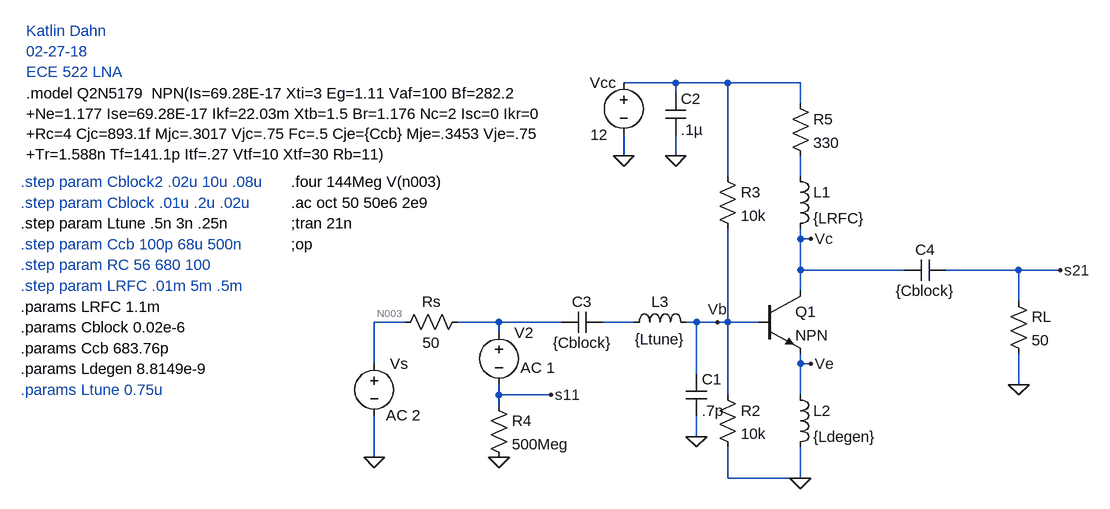
[diagram p0: schematic ECE_522_LNA_v3.asc]
ECE_522_LNA_v3.asc, the LTspice schematic file:
Version 4
SHEET 1 880 680
WIRE -544 -496 -624 -496
WIRE -464 -496 -544 -496
WIRE -352 -496 -464 -496
WIRE -544 -480 -544 -496
WIRE -352 -464 -352 -496
WIRE -624 -384 -624 -416
WIRE -544 -384 -544 -416
WIRE -464 -352 -464 -496
WIRE -352 -352 -352 -384
WIRE -352 -256 -352 -272
WIRE -336 -256 -352 -256
WIRE -352 -208 -352 -256
WIRE -192 -208 -352 -208
WIRE -16 -208 -128 -208
WIRE 48 -208 -16 -208
WIRE -352 -176 -352 -208
WIRE -16 -160 -16 -208
WIRE -960 -128 -1008 -128
WIRE -816 -128 -880 -128
WIRE -720 -128 -816 -128
WIRE -608 -128 -656 -128
WIRE -512 -128 -528 -128
WIRE -480 -128 -512 -128
WIRE -464 -128 -464 -272
WIRE -464 -128 -480 -128
WIRE -416 -128 -464 -128
WIRE -816 -112 -816 -128
WIRE -1008 -64 -1008 -128
WIRE -352 -64 -352 -80
WIRE -336 -64 -352 -64
WIRE -512 -48 -512 -128
WIRE -16 -32 -16 -80
WIRE -816 -16 -816 -32
WIRE -736 -16 -816 -16
WIRE -464 -16 -464 -128
WIRE -352 -16 -352 -64
WIRE -816 0 -816 -16
WIRE -512 48 -512 16
WIRE -1008 80 -1008 16
WIRE -464 112 -464 64
WIRE -352 112 -352 64
WIRE -352 112 -464 112
FLAG -624 -384 0
FLAG -352 112 0
FLAG -544 -384 0
FLAG -1008 80 0
FLAG -16 -32 0
FLAG -816 80 0
FLAG -736 -16 s11
FLAG 48 -208 s21
FLAG -336 -256 Vc
FLAG -336 -64 Ve
FLAG -480 -128 Vb
FLAG -512 48 0
SYMBOL voltage -624 -512 R0
WINDOW 123 0 0 Left 2
WINDOW 39 0 0 Left 2
WINDOW 0 -52 16 Left 2
WINDOW 3 -51 96 Left 2
SYMATTR InstName Vcc
SYMATTR Value 12
SYMBOL npn -416 -176 R0
SYMATTR InstName Q1
SYMBOL cap -560 -480 R0
SYMATTR InstName C2
SYMATTR Value .1µ
SYMBOL res -480 -32 R0
SYMATTR InstName R2
SYMATTR Value 10k
SYMBOL res -480 -368 R0
SYMATTR InstName R3
SYMATTR Value 10k
SYMBOL cap -656 -144 R90
WINDOW 0 0 32 VBottom 2
WINDOW 3 32 32 VTop 2
SYMATTR InstName C3
SYMATTR Value {Cblock}
SYMBOL cap -128 -224 R90
WINDOW 0 0 32 VBottom 2
WINDOW 3 32 32 VTop 2
SYMATTR InstName C4
SYMATTR Value {Cblock}
SYMBOL voltage -1008 -80 R0
WINDOW 3 -235 93 Left 2
WINDOW 123 18 95 Left 2
WINDOW 39 0 0 Left 2
SYMATTR Value ""
SYMATTR Value2 AC 2
SYMATTR InstName Vs
SYMBOL res -32 -176 R0
SYMATTR InstName RL
SYMATTR Value 50
SYMBOL res -864 -144 R90
WINDOW 0 0 56 VBottom 2
WINDOW 3 32 56 VTop 2
SYMATTR InstName Rs
SYMATTR Value 50
SYMBOL voltage -816 -128 R0
WINDOW 123 33 70 Left 2
WINDOW 39 0 0 Left 2
SYMATTR Value2 AC 1
SYMATTR InstName V2
SYMATTR Value ""
SYMBOL res -832 -16 R0
SYMATTR InstName R4
SYMATTR Value 500Meg
SYMBOL res -368 -480 R0
SYMATTR InstName R5
SYMATTR Value 330
SYMBOL ind -368 -368 R0
SYMATTR InstName L1
SYMATTR Value {LRFC}
SYMBOL ind -368 -32 R0
SYMATTR InstName L2
SYMATTR Value {Ldegen}
SYMBOL ind -624 -112 R270
WINDOW 0 32 56 VTop 2
WINDOW 3 5 56 VBottom 2
SYMATTR InstName L3
SYMATTR Value {Ltune}
SYMBOL cap -528 -48 R0
SYMATTR InstName C1
SYMATTR Value .7p
TEXT -1544 -480 Left 2 !.model Q2N5179  NPN(Is=69.28E-17 Xti=3 Eg=1.11 Vaf=100 Bf=282.2 \n+Ne=1.177 Ise=69.28E-17 Ikf=22.03m Xtb=1.5 Br=1.176 Nc=2 Isc=0 Ikr=0 \n+Rc=4 Cjc=893.1f Mjc=.3017 Vjc=.75 Fc=.5 Cje={Ccb} Mje=.3453 Vje=.75 \n+Tr=1.588n Tf=141.1p Itf=.27 Vtf=10 Xtf=30 Rb=11)
TEXT -1136 -280 Left 2 !;tran 21n
TEXT -1552 -120 Left 2 !.params Cblock 0.02e-6
TEXT -1136 -344 Left 2 !.four 144Meg V(n003)
TEXT -1552 -184 Left 2 ;.step param LRFC .01m 5m .5m
TEXT -1552 -152 Left 2 !.params LRFC 1.1m
TEXT -1136 -312 Left 2 !.ac oct 50 50e6 2e9
TEXT -1552 -216 Left 2 ;.step param RC 56 680 100
TEXT -1136 -248 Left 2 !;op
TEXT -1552 -248 Left 2 ;.step param Ccb 100p 68u 500n
TEXT -1552 -312 Left 2 ;.step param Cblock .01u .2u .02u
TEXT -1552 -280 Left 2 !.step param Ltune .5n 3n .25n
TEXT -1552 -24 Left 2 ;.params Ltune 0.75u
TEXT -1552 -344 Left 2 ;.step param Cblock2 .02u 10u .08u
TEXT -1552 -88 Left 2 !.params Ccb 683.76p
TEXT -1552 -56 Left 2 !.params Ldegen 8.8149e-9
TEXT -1544 -576 Left 2 ;Katlin Dahn \n02-27-18\nECE 522 LNA

The netlist it stands for:
* ECE_522_LNA_v3.asc
Vcc N001 0 12
Q1 Vc Vb Ve 0 NPN
C2 N001 0 .1µ
R2 Vb 0 10k
R3 N001 Vb 10k
C3 N005 N004 {Cblock}
C4 s21 Vc {Cblock}
Vs N003 0 AC 2
RL s21 0 50
Rs N004 N003 50
V2 N004 s11 AC 1
R4 s11 0 500Meg
R5 N001 N002 330
L1 N002 Vc {LRFC}
L2 Ve 0 {Ldegen}
L3 N005 Vb {Ltune}
C1 Vb 0 .7p
.model NPN NPN
.model PNP PNP
.lib standard.bjt
.model Q2N5179  NPN(Is=69.28E-17 Xti=3 Eg=1.11 Vaf=100 Bf=282.2
+Ne=1.177 Ise=69.28E-17 Ikf=22.03m Xtb=1.5 Br=1.176 Nc=2 Isc=0 Ikr=0
+Rc=4 Cjc=893.1f Mjc=.3017 Vjc=.75 Fc=.5 Cje={Ccb} Mje=.3453 Vje=.75
+Tr=1.588n Tf=141.1p Itf=.27 Vtf=10 Xtf=30 Rb=11)
;tran 21n
.params Cblock 0.02e-6
.four 144Meg V(n003)
* .step param LRFC .01m 5m .5m
.params LRFC 1.1m
.ac oct 50 50e6 2e9
* .step param RC 56 680 100
;op
* .step param Ccb 100p 68u 500n
* .step param Cblock .01u .2u .02u
.step param Ltune .5n 3n .25n
* .params Ltune 0.75u
* .step param Cblock2 .02u 10u .08u
.params Ccb 683.76p
.params Ldegen 8.8149e-9
* Katlin Dahn
* 02-27-18
* ECE 522 LNA
.backanno
.end